# Altium schematic sheet clock.SchDoc: Clock
size 420 x 297 mm
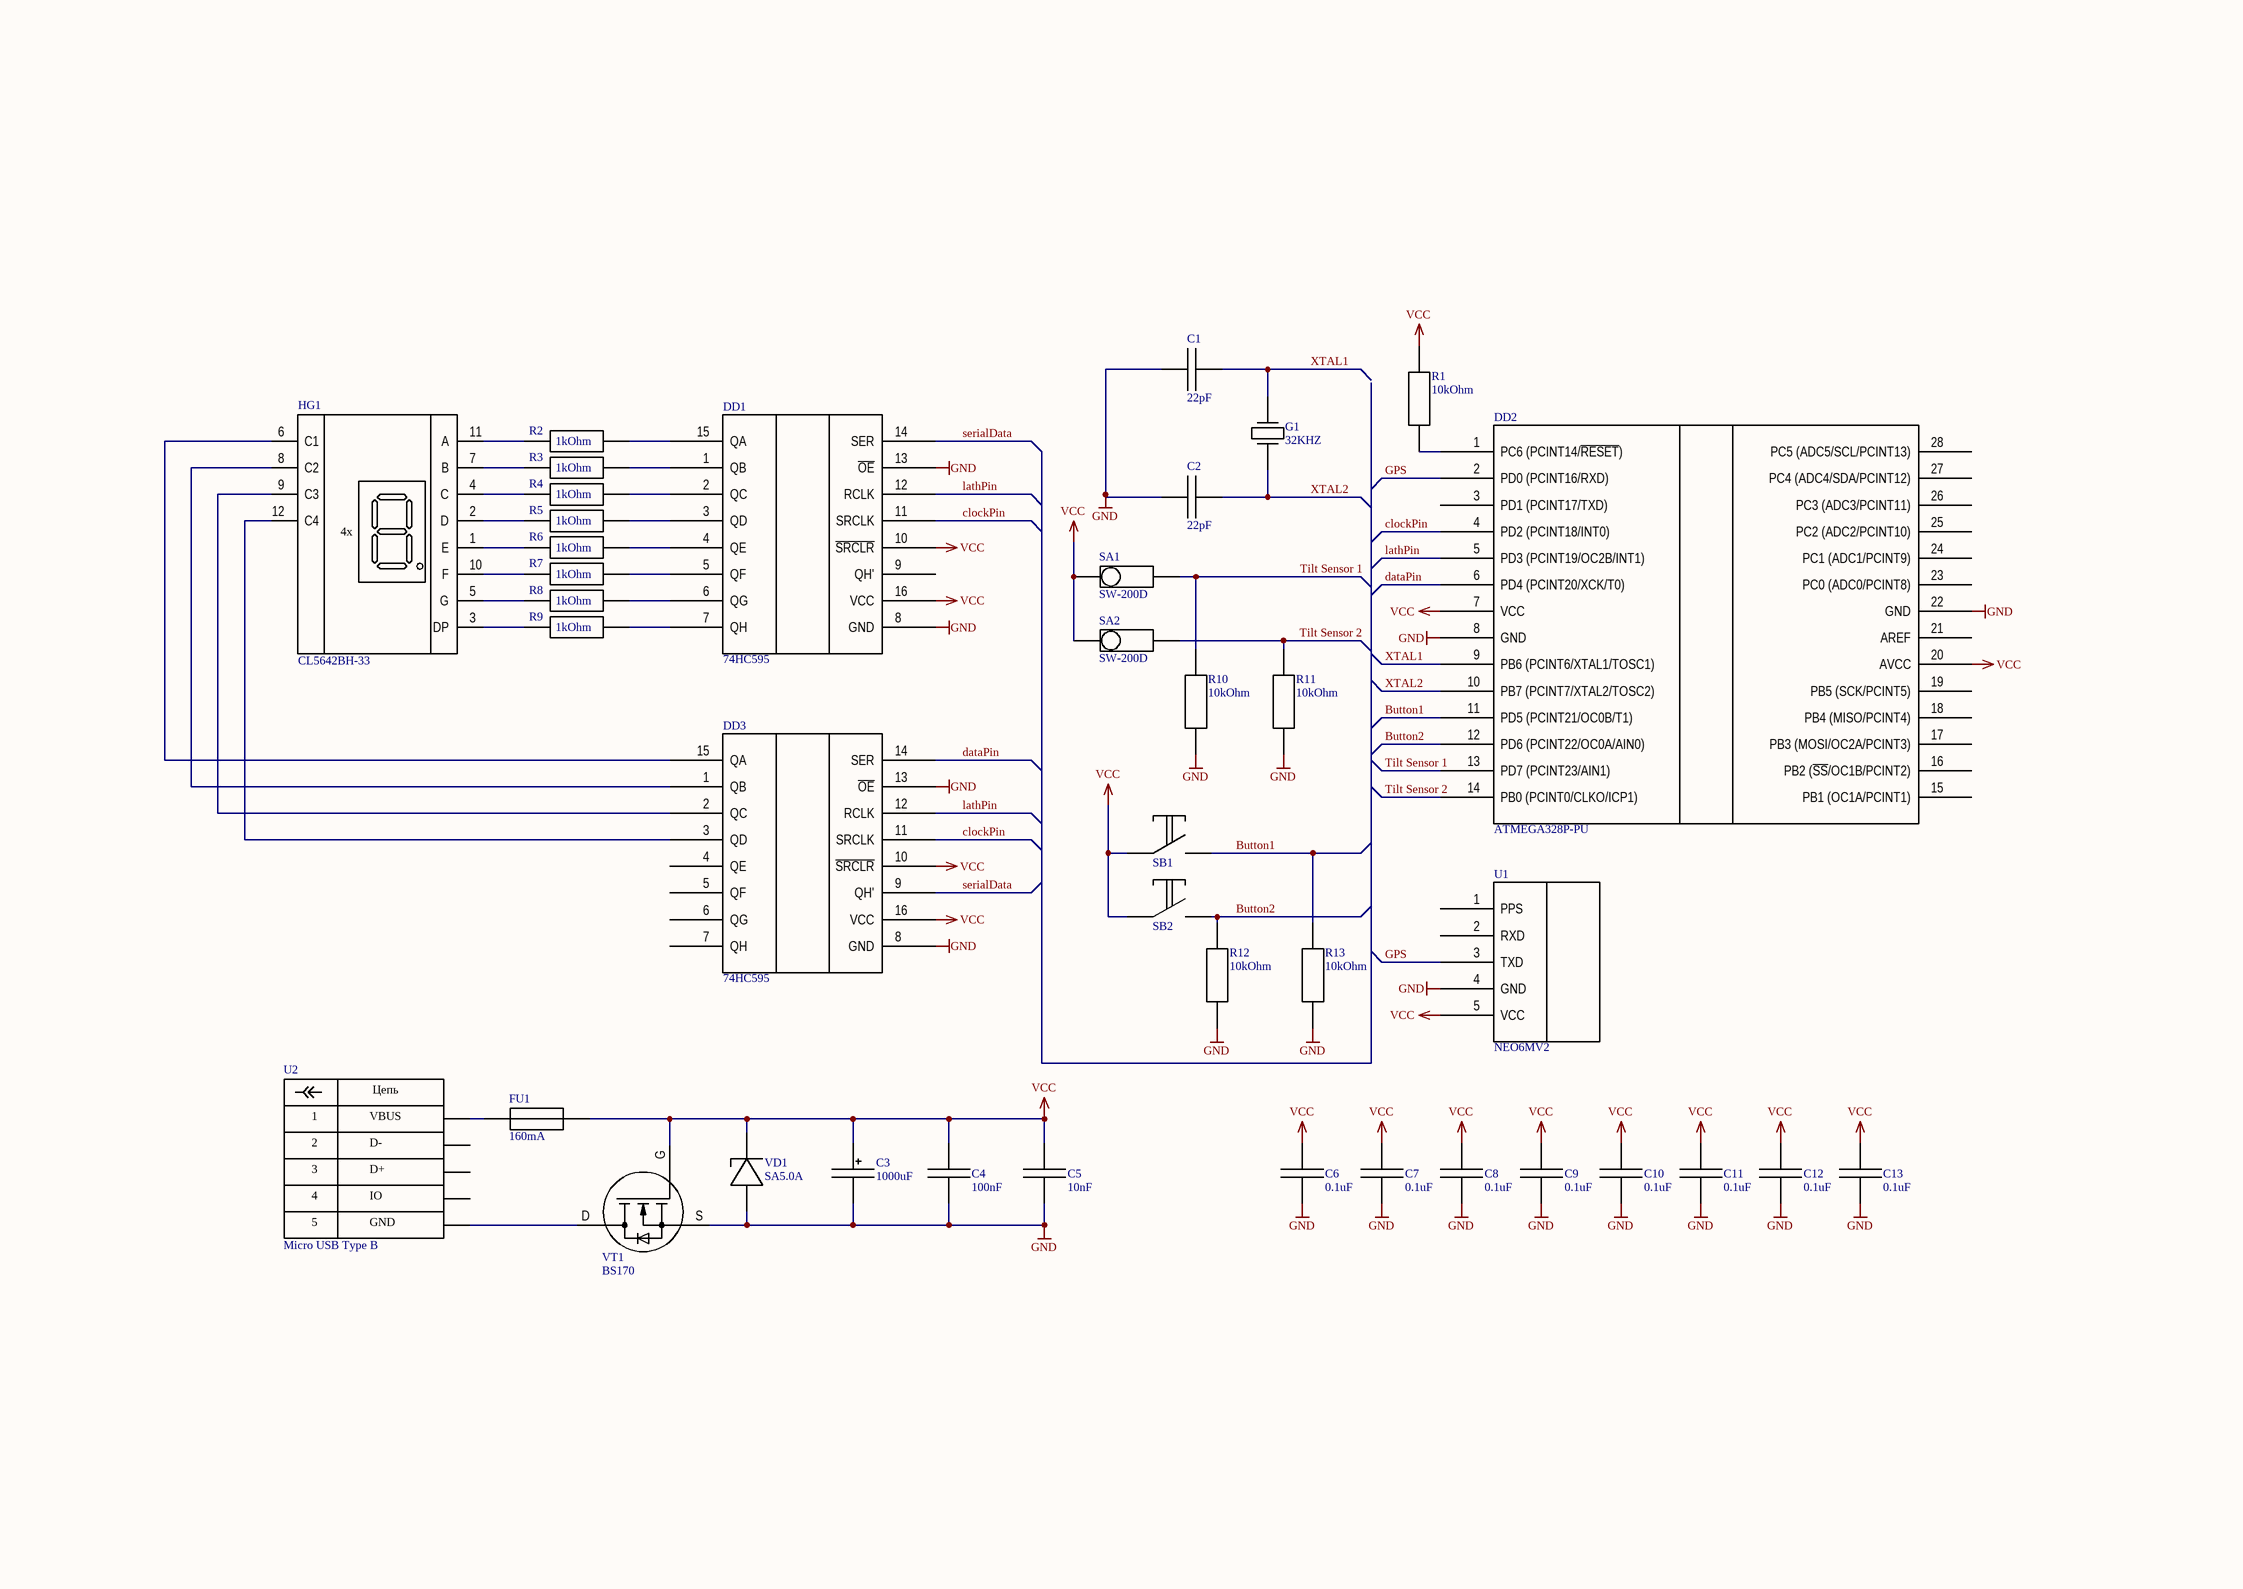
[diagram p0: clock.SchDoc]

## Parts
C1  value 22pF  (hidden comment: Ceramic capacitor)
C2  value 22pF  (hidden comment: Ceramic capacitor)
C3  value 1000uF  (hidden comment: Electrolytic capacitor)
C4  value 100nF  (hidden comment: Ceramic capacitor)
C5  value 10nF  (hidden comment: Ceramic capacitor)
C6  value 0.1uF  (hidden comment: Ceramic capacitor)
C7  value 0.1uF  (hidden comment: Ceramic capacitor)
C8  value 0.1uF  (hidden comment: Ceramic capacitor)
C9  value 0.1uF  (hidden comment: Ceramic capacitor)
C10  value 0.1uF  (hidden comment: Ceramic capacitor)
C11  value 0.1uF  (hidden comment: Ceramic capacitor)
C12  value 0.1uF  (hidden comment: Ceramic capacitor)
C13  value 0.1uF  (hidden comment: Ceramic capacitor)
DD1  74HC595
DD2  ATMEGA328P-PU
DD3  74HC595
FU1  value 160mA  (hidden comment: Fuse)
G1  value 32KHZ  (hidden comment: Crystal oscillator)
HG1  CL5642BH-33
R1  value 10kOhm  (hidden comment: Resistor)
R2  value 1kOhm  (hidden comment: Resistor)
R3  value 1kOhm  (hidden comment: Resistor)
R4  value 1kOhm  (hidden comment: Resistor)
R5  value 1kOhm  (hidden comment: Resistor)
R6  value 1kOhm  (hidden comment: Resistor)
R7  value 1kOhm  (hidden comment: Resistor)
R8  value 1kOhm  (hidden comment: Resistor)
R9  value 1kOhm  (hidden comment: Resistor)
R10  value 10kOhm  (hidden comment: Resistor)
R11  value 10kOhm  (hidden comment: Resistor)
R12  value 10kOhm  (hidden comment: Resistor)
R13  value 10kOhm  (hidden comment: Resistor)
SA1  SW-200D
SA2  SW-200D
SB1  Switch button  (value not drawn)
SB2  Switch button  (value not drawn)
U1  NEO6MV2
U2  Micro USB Type B
VD1  SA5.0A
VT1  BS170

## Nets
GND: C1.19 C2.19 C3.19 C4.20 C5.20 C6.20 C7.20 C8.20 C9.20 C10.20 C11.20 C12.20 C13.20 DD1.8(GND) DD1.13(~{OE}) DD2.8(GND) DD2.22(GND) DD3.8(GND) DD3.13(~{OE}) R10.2 R11.2 R12.2 R13.2 U1.4(GND) VD1.8 VT1.S
VCC: C3.20 C4.19 C5.19 C6.19 C7.19 C8.19 C9.19 C10.19 C11.19 C12.19 C13.19 DD1.10(~{SRCLR}) DD1.16(VCC) DD2.7(VCC) DD2.20(AVCC) DD3.10(~{SRCLR}) DD3.16(VCC) FU1.3 R1.3 SA1.1 SA2.1 SB1.17 SB2.17 U1.5(VCC) VD1.9 VT1.G
Button1: DD2.11(PD5_(PCINT21/OC0B/T1)) R13.3 SB1.18
Button2: DD2.12(PD6_(PCINT22/OC0A/AIN0)) R12.3 SB2.18
clockPin: DD1.11(SRCLK) DD2.4(PD2_(PCINT18/INT0)) DD3.11(SRCLK)
dataPin: DD2.6(PD4_(PCINT20/XCK/T0)) DD3.14(SER)
GPS: DD2.2(PD0_(PCINT16/RXD)) U1.3(TXD)
lathPin: DD1.12(RCLK) DD2.5(PD3_(PCINT19/OC2B/INT1)) DD3.12(RCLK)
serialData: DD1.14(SER) DD3.9(QH')
Tilt Sensor 1: DD2.13(PD7_(PCINT23/AIN1)) R10.3 SA1.2
Tilt Sensor 2: DD2.14(PB0_(PCINT0/CLKO/ICP1)) R11.3 SA2.2
XTAL1: C1.20 DD2.9(PB6_(PCINT6/XTAL1/TOSC1)) G1.7
XTAL2: C2.20 DD2.10(PB7_(PCINT7/XTAL2/TOSC2)) G1.6
NetDD1_1: DD1.1(QB) R3.2
NetDD1_2: DD1.2(QC) R4.2
NetDD1_3: DD1.3(QD) R5.2
NetDD1_4: DD1.4(QE) R6.2
NetDD1_5: DD1.5(QF) R7.2
NetDD1_6: DD1.6(QG) R8.2
NetDD1_7: DD1.7(QH) R9.2
NetDD1_15: DD1.15(QA) R2.2
NetDD2_1: DD2.1(PC6_(PCINT14/~{RESET})) R1.2
NetDD3_1: DD3.1(QB) HG1.8(C2)
NetDD3_2: DD3.2(QC) HG1.9(C3)
NetDD3_3: DD3.3(QD) HG1.12(C4)
NetDD3_15: DD3.15(QA) HG1.6(C1)
NetFU1_2: FU1.2 U2.1(VBUS)
NetHG1_1: HG1.1(E) R6.3
NetHG1_2: HG1.2(D) R5.3
NetHG1_3: HG1.3(DP) R9.3
NetHG1_4: HG1.4(C) R4.3
NetHG1_5: HG1.5(G) R8.3
NetHG1_7: HG1.7(B) R3.3
NetHG1_10: HG1.10(F) R7.3
NetHG1_11: HG1.11(A) R2.3
NetU2_5: U2.5(GND) VT1.D

Not connected (* = marked no-connect by the designer): DD1 9(QH'); DD2 3(PD1_(PCINT17/TXD)) 15(PB1_(OC1A/PCINT1)) 16(PB2_(~{SS}/OC1B/PCINT2)) 17(PB3_(MOSI/OC2A/PCINT3)) 18(PB4_(MISO/PCINT4)) 19(PB5_(SCK/PCINT5)) 21(AREF) 23(PC0_(ADC0/PCINT8)) 24(PC1_(ADC1/PCINT9)) 25(PC2_(ADC2/PCINT10)) 26(PC3_(ADC3/PCINT11)) 27(PC4_(ADC4/SDA/PCINT12)) 28(PC5_(ADC5/SCL/PCINT13)); DD3 4(QE) 5(QF) 6(QG) 7(QH); U1 1(PPS) 2(RXD); U2 2(D-) 3(D+) 4(IO)

## Notes on the sheet
- (in symbol CL5642BH-33) 4x
- (in symbol Micro USB Type B) Цепь